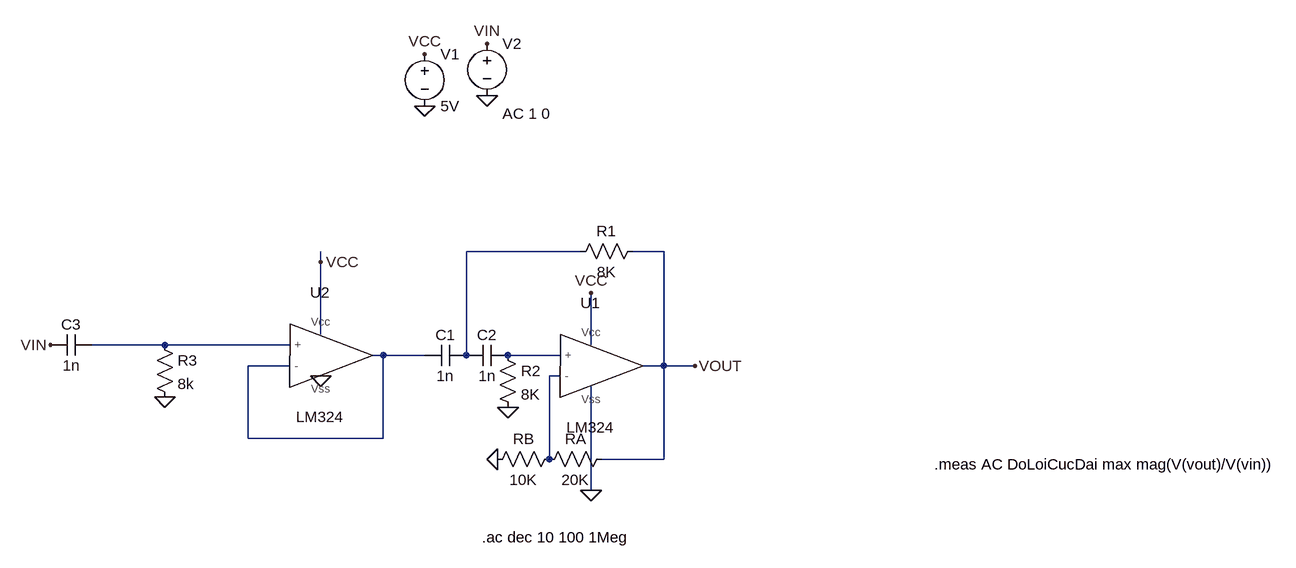
[diagram p0: schematic BAI 4 CHUAN BI 3.asc]
BAI 4 CHUAN BI 3.asc, the LTspice schematic file:
Version 4.1
SHEET 1 1336 680
WIRE 224 -64 48 -64
WIRE 352 -64 304 -64
WIRE -176 -48 -176 -64
WIRE -176 64 -176 -48
WIRE -416 80 -528 80
WIRE -224 80 -416 80
WIRE 240 80 240 0
WIRE -80 96 -96 96
WIRE -16 96 -80 96
WIRE 48 96 48 -64
WIRE 192 96 112 96
WIRE -224 112 -288 112
WIRE 352 112 352 -64
WIRE 352 112 320 112
WIRE 400 112 352 112
WIRE 192 128 176 128
WIRE -288 224 -288 112
WIRE -80 224 -80 96
WIRE -80 224 -288 224
WIRE 176 256 176 128
WIRE 352 256 352 112
WIRE 352 256 256 256
WIRE 240 304 240 144
FLAG 400 112 VOUT
FLAG 112 176 0
FLAG 96 256 0
FLAG 240 0 VCC
FLAG 80 -304 0
FLAG -16 -288 0
FLAG -16 -368 VCC
FLAG 80 -384 VIN
FLAG 240 304 0
FLAG -176 128 0
FLAG -176 -48 VCC
FLAG -592 80 VIN
FLAG -416 160 0
SYMBOL LM324 240 112 R0
SYMATTR InstName U1
SYMBOL res 320 -80 R90
WINDOW 0 0 56 VBottom 2
WINDOW 3 32 56 VTop 2
SYMATTR InstName R1
SYMATTR Value 8K
SYMBOL cap 48 80 R90
WINDOW 0 0 32 VBottom 2
WINDOW 3 32 32 VTop 2
SYMATTR InstName C1
SYMATTR Value 1n
SYMBOL cap 112 80 R90
WINDOW 0 0 32 VBottom 2
WINDOW 3 32 32 VTop 2
SYMATTR InstName C2
SYMATTR Value 1n
SYMBOL res 96 80 R0
SYMATTR InstName R2
SYMATTR Value 8K
SYMBOL res 272 240 R90
WINDOW 0 0 56 VBottom 2
WINDOW 3 32 56 VTop 2
SYMATTR InstName RA
SYMATTR Value 20K
SYMBOL res 192 240 R90
WINDOW 0 0 56 VBottom 2
WINDOW 3 32 56 VTop 2
SYMATTR InstName RB
SYMATTR Value 10K
SYMBOL voltage -16 -384 R0
SYMATTR InstName V1
SYMATTR Value 5V
SYMBOL voltage 80 -400 R0
WINDOW 123 24 124 Left 2
WINDOW 39 0 0 Left 0
SYMATTR Value2 AC 1 0
SYMATTR InstName V2
SYMATTR Value ""
SYMBOL LM324 -176 96 R0
SYMATTR InstName U2
SYMBOL res -432 64 R0
SYMATTR InstName R3
SYMATTR Value 8k
SYMBOL cap -528 64 R90
WINDOW 0 0 32 VBottom 2
WINDOW 3 32 32 VTop 2
SYMATTR InstName C3
SYMATTR Value 1n
TEXT 72 376 Left 2 !.ac dec 10 100 1Meg
TEXT 768 264 Left 2 !.meas AC DoLoiCucDai max mag(V(vout)/V(vin))

The netlist it stands for:
* BAI 4 CHUAN BI 3.asc
X§U1 N004 N005 VCC 0 VOUT LM324  ; pins + - Vcc Vss ?
R1 VOUT N001 8K
C1 N001 N003 1n
C2 N004 N001 1n
R2 N004 0 8K
RA VOUT N005 20K
RB N005 0 10K
V1 VCC 0 5V
V2 VIN 0 AC 1 0
X§U2 N002 N003 VCC 0 N003 LM324  ; pins + - Vcc Vss ?
R3 N002 0 8k
C3 N002 VIN 1n
.ac dec 10 100 1Meg
.meas AC DoLoiCucDai max mag(V(vout)/V(vin))
.lib E:\ThiThucHanhCoHa\CoHa\LM324.cir
.backanno
.end